# EAGLE board MainBoard_V1.3 (EAGLE 7.2.0), part 1 of 2
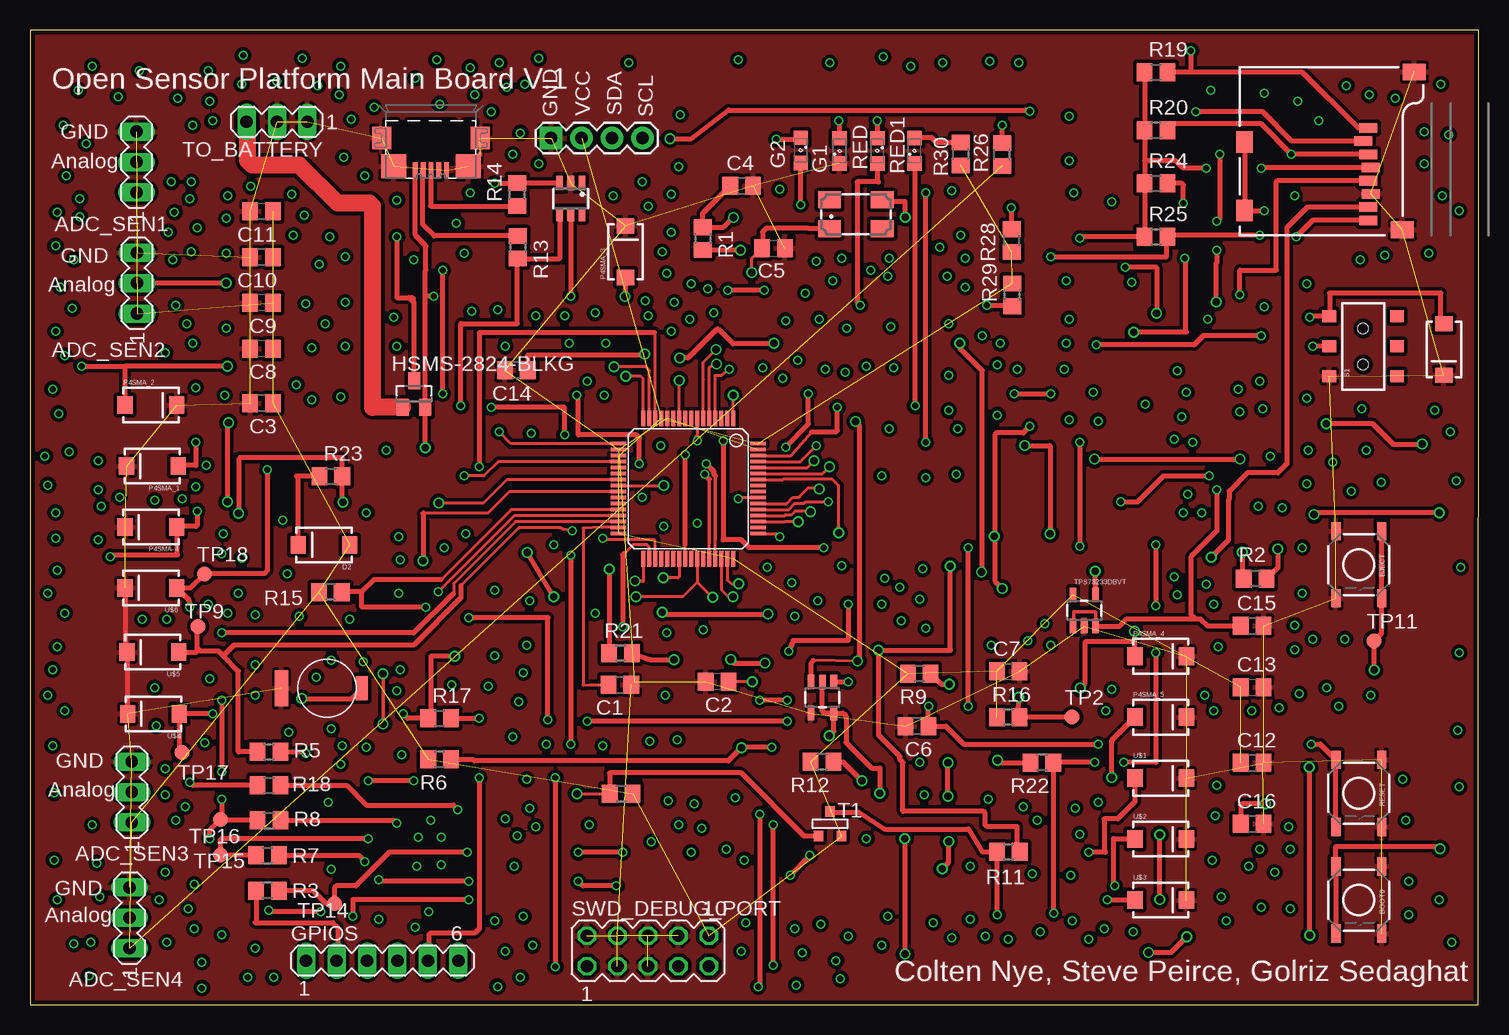
[diagram p1: board, top side]
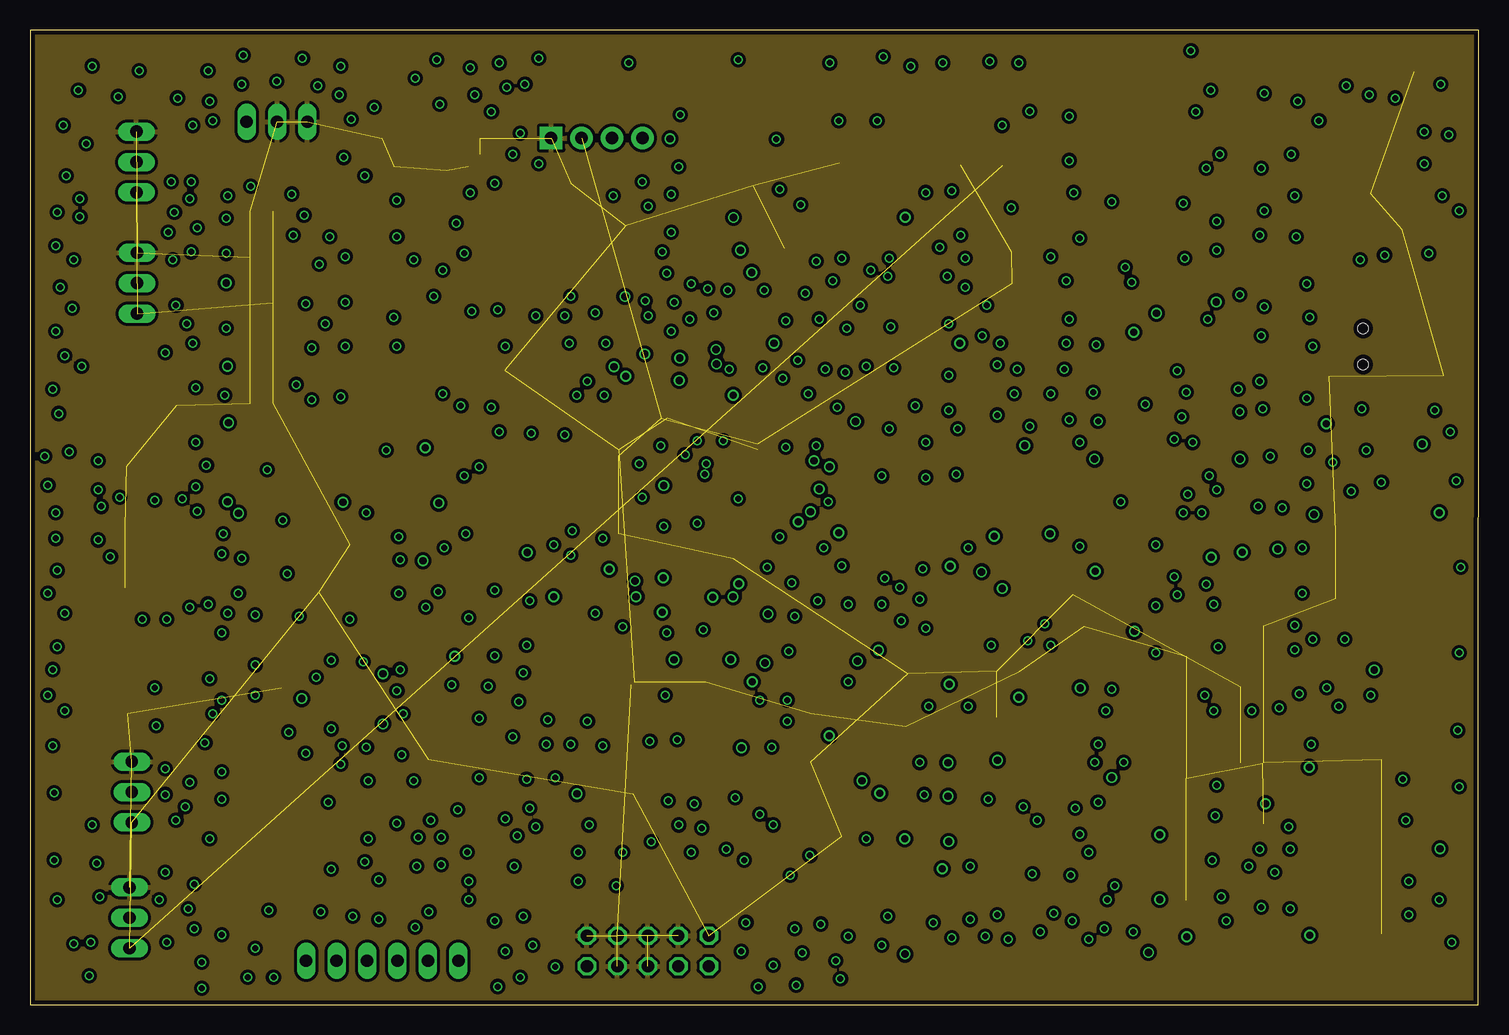
[diagram p2: board, inner layer GND]
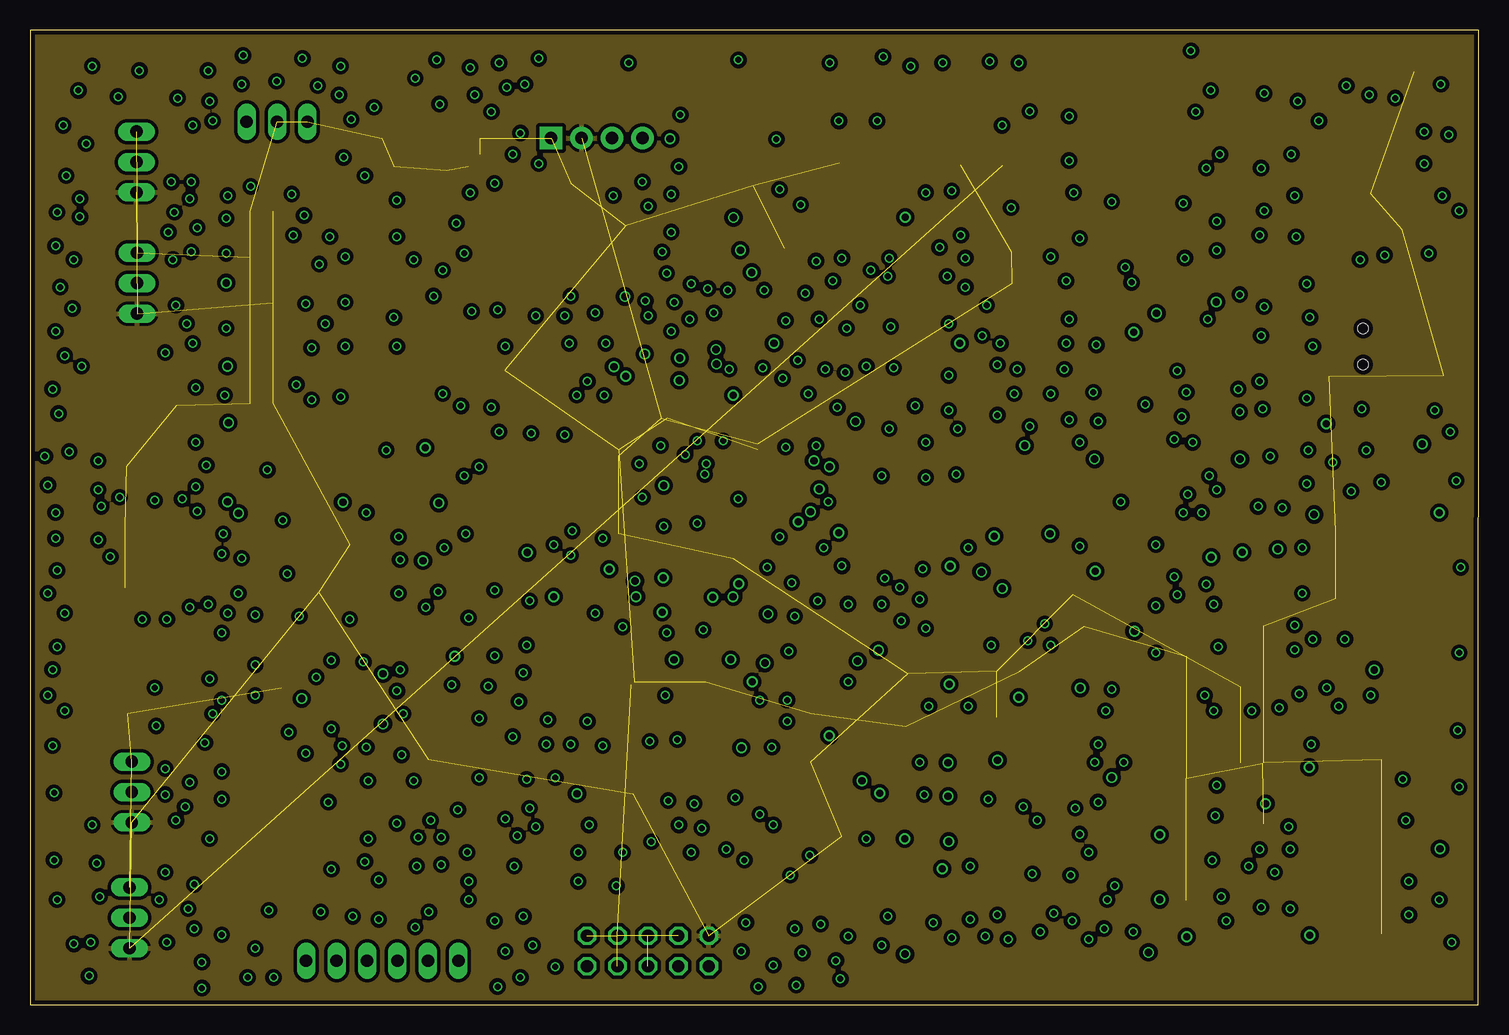
[diagram p3: board, inner layer +3V3]
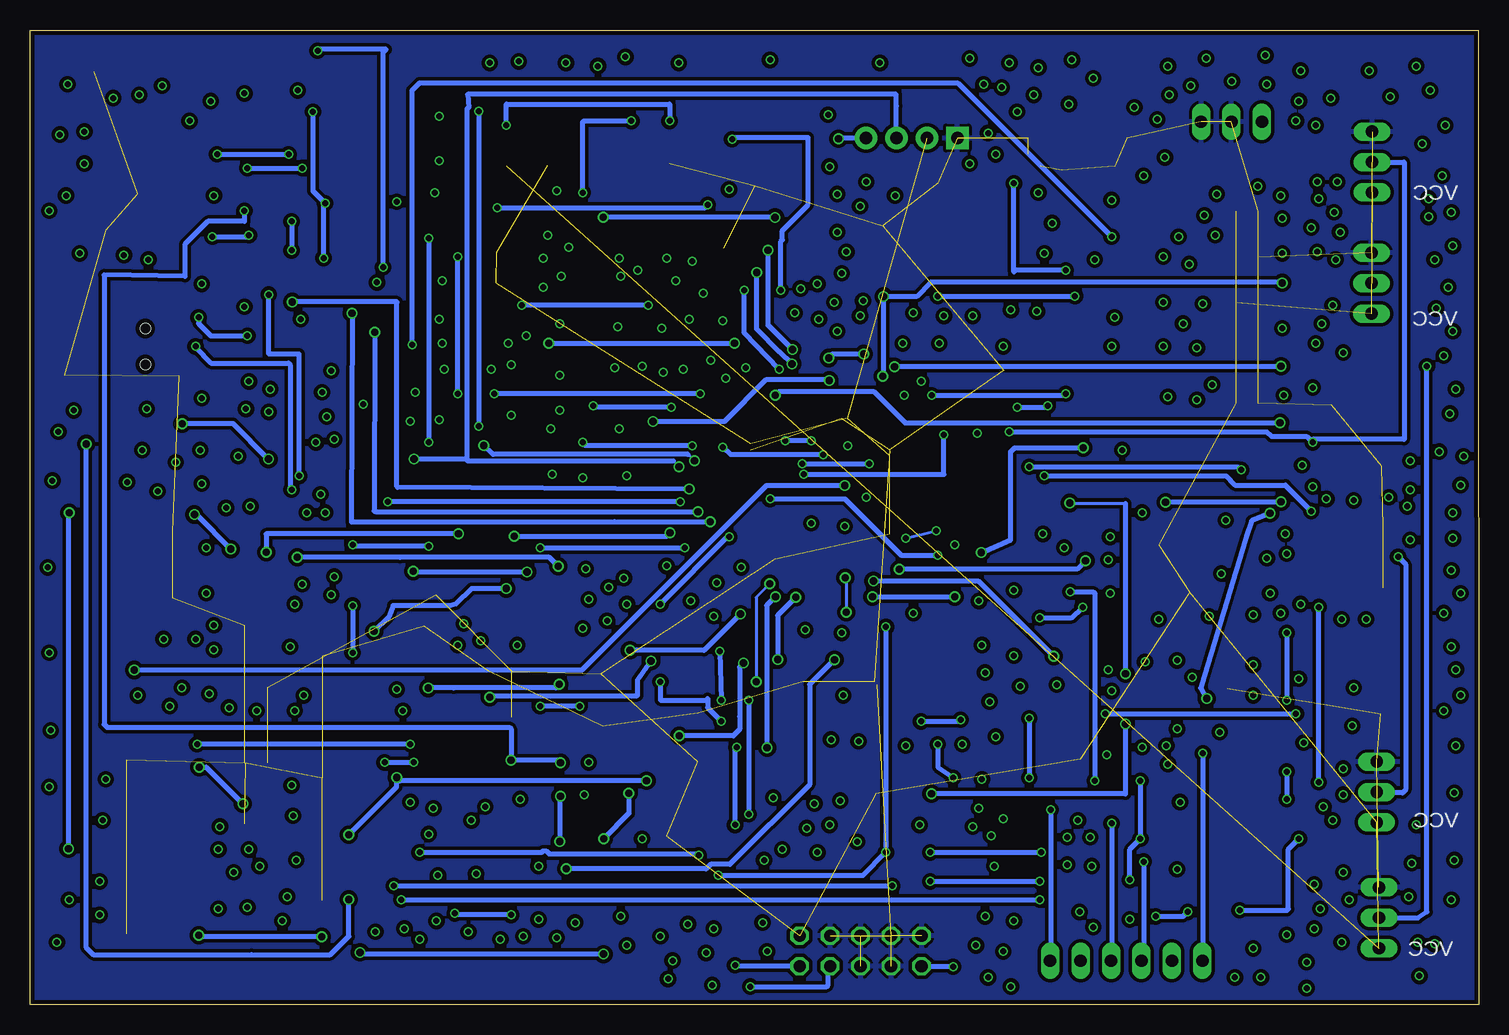
[diagram p4: board, bottom side, seen from below]

Size 120.71 x 81.23 mm. Coordinates in mm from the lower left corner, seen from the top.
Outline: 0,0 120.7,0.01 120.71,81.23 0.01,81.22 0,0
Copper layers (1*2*15*16): Top 0.035559375mm / dielectric 0.17018125mm / GND 0.01778125mm / dielectric 47mil / +3V3 0.01778125mm / dielectric 0.17018125mm / Bottom 0.035559375mm
Design rules "OSHPark-4layer": minimum track width 5mil, minimum drill 10mil, track to track 5mil, track to pad 5mil, pad to pad 5mil, via to via 5mil, smd to smd 5mil, copper to edge 15mil, drill to drill 6mil, minimum pad ring 4mil, minimum via ring 4mil, stop-mask expansion 4mil, vias tented up to drill 0mil, thermal gap 10mil

## Footprints (pad centres in the part's own frame; a part is rotated, then mirrored left to right if it is on the bottom)
CTS406 = smd 1.9 x 1.4: 1 -2.2,-1.2; 2 2.2,-1.2; 3 2.2,1.2; 4 -2.2,1.2
MA03-1 = drill 1.016 long: 1 -2.54,0; 2 0,0; 3 2.54,0
TACTILE-SWITCH-SMD = smd 1.524 x 0.762: 1 -2.794,1.905; 2 2.794,1.905; 3 -2.794,-1.905; 4 2.794,-1.905
C0805 = smd 1.3 x 1.5: 1 -0.95,0; 2 0.95,0
SOT23-5 = smd 0.55 x 1.2: 1 -0.95,-1.3; 2 0,-1.3; 3 0.95,-1.3; 4 0.95,1.3; 5 -0.95,1.3
SMA-DIODE = smd 1.27 x 1.47: A -2.15,0; C 2.15,0
SML0805 = smd 1.2 x 1.2: A 1.05,0; C -1.05,0
MA06-1 = drill 1.016 long: 1 -6.35,0; 2 -3.81,0; 3 -1.27,0; 4 1.27,0; 5 3.81,0; 6 6.35,0
SOT23 = smd 1 x 1.4: 1 -0.95,-1.1; 2 0.95,-1.1; 3 0,1.1
1X04 = drill 1.016 pad 1.88 square: 1 0,0 | drill 1.016 pad 1.88: 2 2.54,0; 3 5.08,0; 4 7.62,0
R0805 = smd 1.3 x 1.5: 1 -0.95,0; 2 0.95,0
SOT23-6 = smd 0.55 x 1.2: 1 -0.95,-1.3; 2 0,-1.3; 3 0.95,-1.3; 4 0.95,1.3; 5 0,1.3; 6 -0.95,1.3
AYZ0202 = smd 1 x 1.15: 1 -2.5,2.825; 2 0,2.825; 3 2.5,2.825; 4 -2.5,-2.825; 5 0,-2.825; 6 2.5,-2.825 | hole 0.85: 1.5,0; -1.5,0
414-VA5R = smd 1 x 2: + -2.9,0 | smd 1.1 x 3: - 3.8,0
MA05-2 = drill 1.016 octagon: 1 -5.08,-1.27; 2 -5.08,1.27; 3 -2.54,-1.27; 4 -2.54,1.27; 5 0,-1.27; 6 0,1.27; 7 2.54,-1.27; 8 2.54,1.27; 9 5.08,-1.27; 10 5.08,1.27
SOT-23 = smd 0.787 x 0.889: 1 0.025,-1.016; 2 -0.94,1.016; 3 0.991,1.016
B1,27 = smd 1.27 x 1.27: TP 0,0
LQFP64 = smd 1.3 x 0.3: 1 -5.85,3.75; 2 -5.85,3.25; 3 -5.85,2.75; 4 -5.85,2.25; 5 -5.85,1.75; 6 -5.85,1.25; 7 -5.85,0.75; 8 -5.85,0.25; 9 -5.85,-0.25; 10 -5.85,-0.75; 11 -5.85,-1.25; 12 -5.85,-1.75; 13 -5.85,-2.25; 14 -5.85,-2.75; 15 -5.85,-3.25; 16 -5.85,-3.75; 33 5.85,-3.75; 34 5.85,-3.25; 35 5.85,-2.75; 36 5.85,-2.25; 37 5.85,-1.75; 38 5.85,-1.25; 39 5.85,-0.75; 40 5.85,-0.25; 41 5.85,0.25; 42 5.85,0.75; 43 5.85,1.25; 44 5.85,1.75; 45 5.85,2.25; 46 5.85,2.75; 47 5.85,3.25; 48 5.85,3.75 | smd 0.3 x 1.3: 17 -3.75,-5.8; 18 -3.25,-5.8; 19 -2.75,-5.8; 20 -2.25,-5.8; 21 -1.75,-5.8; 22 -1.25,-5.8; 23 -0.75,-5.8; 24 -0.25,-5.8; 25 0.25,-5.8; 26 0.75,-5.8; 27 1.25,-5.8; 28 1.75,-5.8; 29 2.25,-5.8; 30 2.75,-5.8; 31 3.25,-5.8; 32 3.75,-5.8; 49 3.75,5.8; 50 3.25,5.8; 51 2.75,5.8; 52 2.25,5.8; 53 1.75,5.8; 54 1.25,5.8; 55 0.75,5.8; 56 0.25,5.8; 57 -0.25,5.8; 58 -0.75,5.8; 59 -1.25,5.8; 60 -1.75,5.8; 61 -2.25,5.8; 62 -2.75,5.8; 63 -3.25,5.8; 64 -3.75,5.8
MICRO-SD-SOCKET-PP = smd 0.8 x 1.5: 1 -8.94,10.7; 2 -7.84,10.3; 3 -6.74,10.7; 4 -5.64,10.9; 5 -4.54,10.7; 6 -3.44,10.9; 7 -2.34,10.7; 8 -1.24,10.7 | smd 1.8 x 1.4: CD1 -2.05,0.4; CD2 -7.75,0.4 | smd 1.4 x 1.9: GND1 -13.6,14.55; GND3 -0.45,13.55
ZX62R-B-5P = smd 1.35 x 0.4: 1 2.675,-1.3; 2 2.675,-0.65; 3 2.675,0; 4 2.675,0.65; 5 2.675,1.3 | smd 1.9 x 1.6: M1 0,-4.1; M2 0,4.1 | smd 2 x 2.1: M3 2.35,3.1; M4 2.35,-3.1

## Placement (x,y rotation side)
406C35E  16meg  [CTS406]  68.82,65.88 0 top
ADC_SEN1  [MA03-1]  8.87,70.23 90 top
ADC_SEN2  [MA03-1]  8.92,60.14 90 top
ADC_SEN3  [MA03-1]  8.49,17.73 90 top
ADC_SEN4  [MA03-1]  8.3,7.24 90 top
BOOT0  Boot0  [TACTILE-SWITCH-SMD]  110.73,8.73 270 top
C1  2.2u  [C0805]  49.15,26.66 0 top
C2  2.2u  [C0805]  57.26,26.92 180 top
C3  100n  [C0805]  19.29,50.13 180 top
C4  22p  [C0805]  59.3,68.25 0 top
C5  22p  [C0805]  61.96,63.05 0 top
C6  0.1u  [C0805]  73.92,23.21 180 top
C7  10u  [C0805]  81.52,27.78 0 top
C8  100n  [C0805]  19.29,54.68 180 top
C9  100n  [C0805]  19.29,58.49 180 top
C10  100n  [C0805]  19.29,62.3 180 top
C11  100n  [C0805]  19.29,66.11 180 top
C12  1u  [C0805]  101.84,20.16 0 top
C13  10u  [C0805]  101.84,26.47 0 top
C14  0.01u  [C0805]  40.53,52.87 180 top
C15  1u  [C0805]  101.84,31.59 0 top
C16  4.7u  [C0805]  101.84,15.08 0 top
CURRENT_LIMITER  STMPS2141STR  [SOT23-5]  66.03,25.6 180 top
D2  [SMA-DIODE]  24.5,38.32 180 top
EJECT  Eject  [TACTILE-SWITCH-SMD]  110.73,36.67 270 top
G1  [SML0805]  67.45,71.16 90 top
G2  [SML0805]  64.23,71.2 270 top
GPIOS  [MA06-1]  29.35,3.67 0 top
HSMS-2824-BLKG  Schottky  [SOT23]  32,50.9 0 top
JP1  I2C Sensor  [1X04]  43.42,72.23 0 top
P4SMA-4  TVS  [SMA-DIODE]  10.08,39.81 180 top
P4SMA_1  TVS  [SMA-DIODE]  10.2,44.89 180 top
P4SMA_2  TVS  [SMA-DIODE]  10.08,49.97 0 top
P4SMA_3  TVS  [SMA-DIODE]  49.63,62.75 90 top
P4SMA_4  TVS  [SMA-DIODE]  94.22,29.05 0 top
P4SMA_5  TVS  [SMA-DIODE]  94.22,23.97 0 top
P4SMA_6  TVS  [SMA-DIODE]  117.83,54.6 270 top
R1  904.3  [R0805]  56.06,63.85 270 top
R2  10k  [R0805]  102.1,35.5 180 top
R3  10k  [R0805]  19.79,9.52 180 top
R5  10k  [R0805]  19.91,21.08 0 top
R6  100k  [R0805]  34.14,20.44 180 top
R7  10k  [R0805]  19.79,12.44 0 top
R8  10k  [R0805]  19.91,15.36 0 top
R9  4.7k  [R0805]  74.11,27.58 180 top
R10  10k  [R0805]  49.27,17.56 180 top
R11  47k  [R0805]  81.53,12.75 0 top
R12  4.7k  [R0805]  66,20.24 180 top
R13  22  [R0805]  40.65,63.12 270 top
R14  22  [R0805]  40.59,67.52 90 top
R15  10k  [R0805]  25.03,34.39 180 top
R16  47k  [R0805]  81.52,23.97 180 top
R17  10k  [R0805]  34.14,23.87 0 top
R18  10k  [R0805]  19.91,18.28 0 top
R19  47k  [R0805]  93.83,77.72 0 top
R20  47k  [R0805]  93.83,72.89 0 top
R21  0  [R0805]  49.21,29.29 180 top
R22  47k  [R0805]  84.32,20.18 180 top
R23  1k  [R0805]  25.07,44.05 0 top
R24  47k  [R0805]  93.83,68.45 0 top
R25  47k  [R0805]  93.83,64 0 top
R26  56  [R0805]  81,70.86 90 top
R28  56  [R0805]  81.82,63.68 90 top
R29  68  [R0805]  81.85,59.16 90 top
R30  68  [R0805]  77.55,70.9 270 top
RCLAMP0504S  [SOT23-6]  45.06,67.18 180 top
RED  [SML0805]  70.61,71.16 270 top
RED1  [SML0805]  73.7,71.16 90 top
RESET  reset  [TACTILE-SWITCH-SMD]  110.73,17.62 270 top
S1  [AYZ0202]  111.1,54.86 90 top
SUPERCAP  [414-VA5R]  24.75,26.36 180 top
SWD_DEBUG_PORT  [MA05-2]  51.49,4.48 0 top
T1  NDS352AP  [SOT-23]  66.7,15.08 180 top
TO_BATTERY  [MA03-1]  20.58,73.58 180 top
TP2  TPB1,27  [B1,27]  86.85,23.97 0 top
TP9  TPB1,27  [B1,27]  14.02,31.53 180 top
TP11  TPB1,27  [B1,27]  112,30.32 0 top
TP14  TPB1,27  [B1,27]  25.39,8.43 0 top
TP15  TPB1,27  [B1,27]  15.88,12.48 0 top
TP16  TPB1,27  [B1,27]  15.86,15.46 0 top
TP17  TPB1,27  [B1,27]  12.66,21.02 0 top
TP18  TPB1,27  [B1,27]  14.55,35.91 0 top
TPS73233DBVT  3.3V  [SOT23-5]  87.86,32.85 0 top
U1  STM32F20XR  [LQFP64]  54.85,43.02 270 top
U2  MicroSDCard  [MICRO-SD-SOCKET-PP]  100.81,64.13 270 top
U$1  TVS  [SMA-DIODE]  94.22,18.89 0 top
U$2  TVS  [SMA-DIODE]  94.22,13.81 0 top
U$3  TVS  [SMA-DIODE]  94.22,8.73 0 top
U$4  TVS  [SMA-DIODE]  10.29,24.24 180 top
U$5  TVS  [SMA-DIODE]  10.24,29.39 180 top
U$6  TVS  [SMA-DIODE]  10.08,34.73 180 top
USB_FS  MICRO-USB-SHIELD-ZX62R-B-5P  [ZX62R-B-5P]  33.41,72.23 270 top